# Altium schematic sheet Analog_Supply_and_TIA.SchDoc
size A3; SheetNumber: 1; SheetTotal: 4
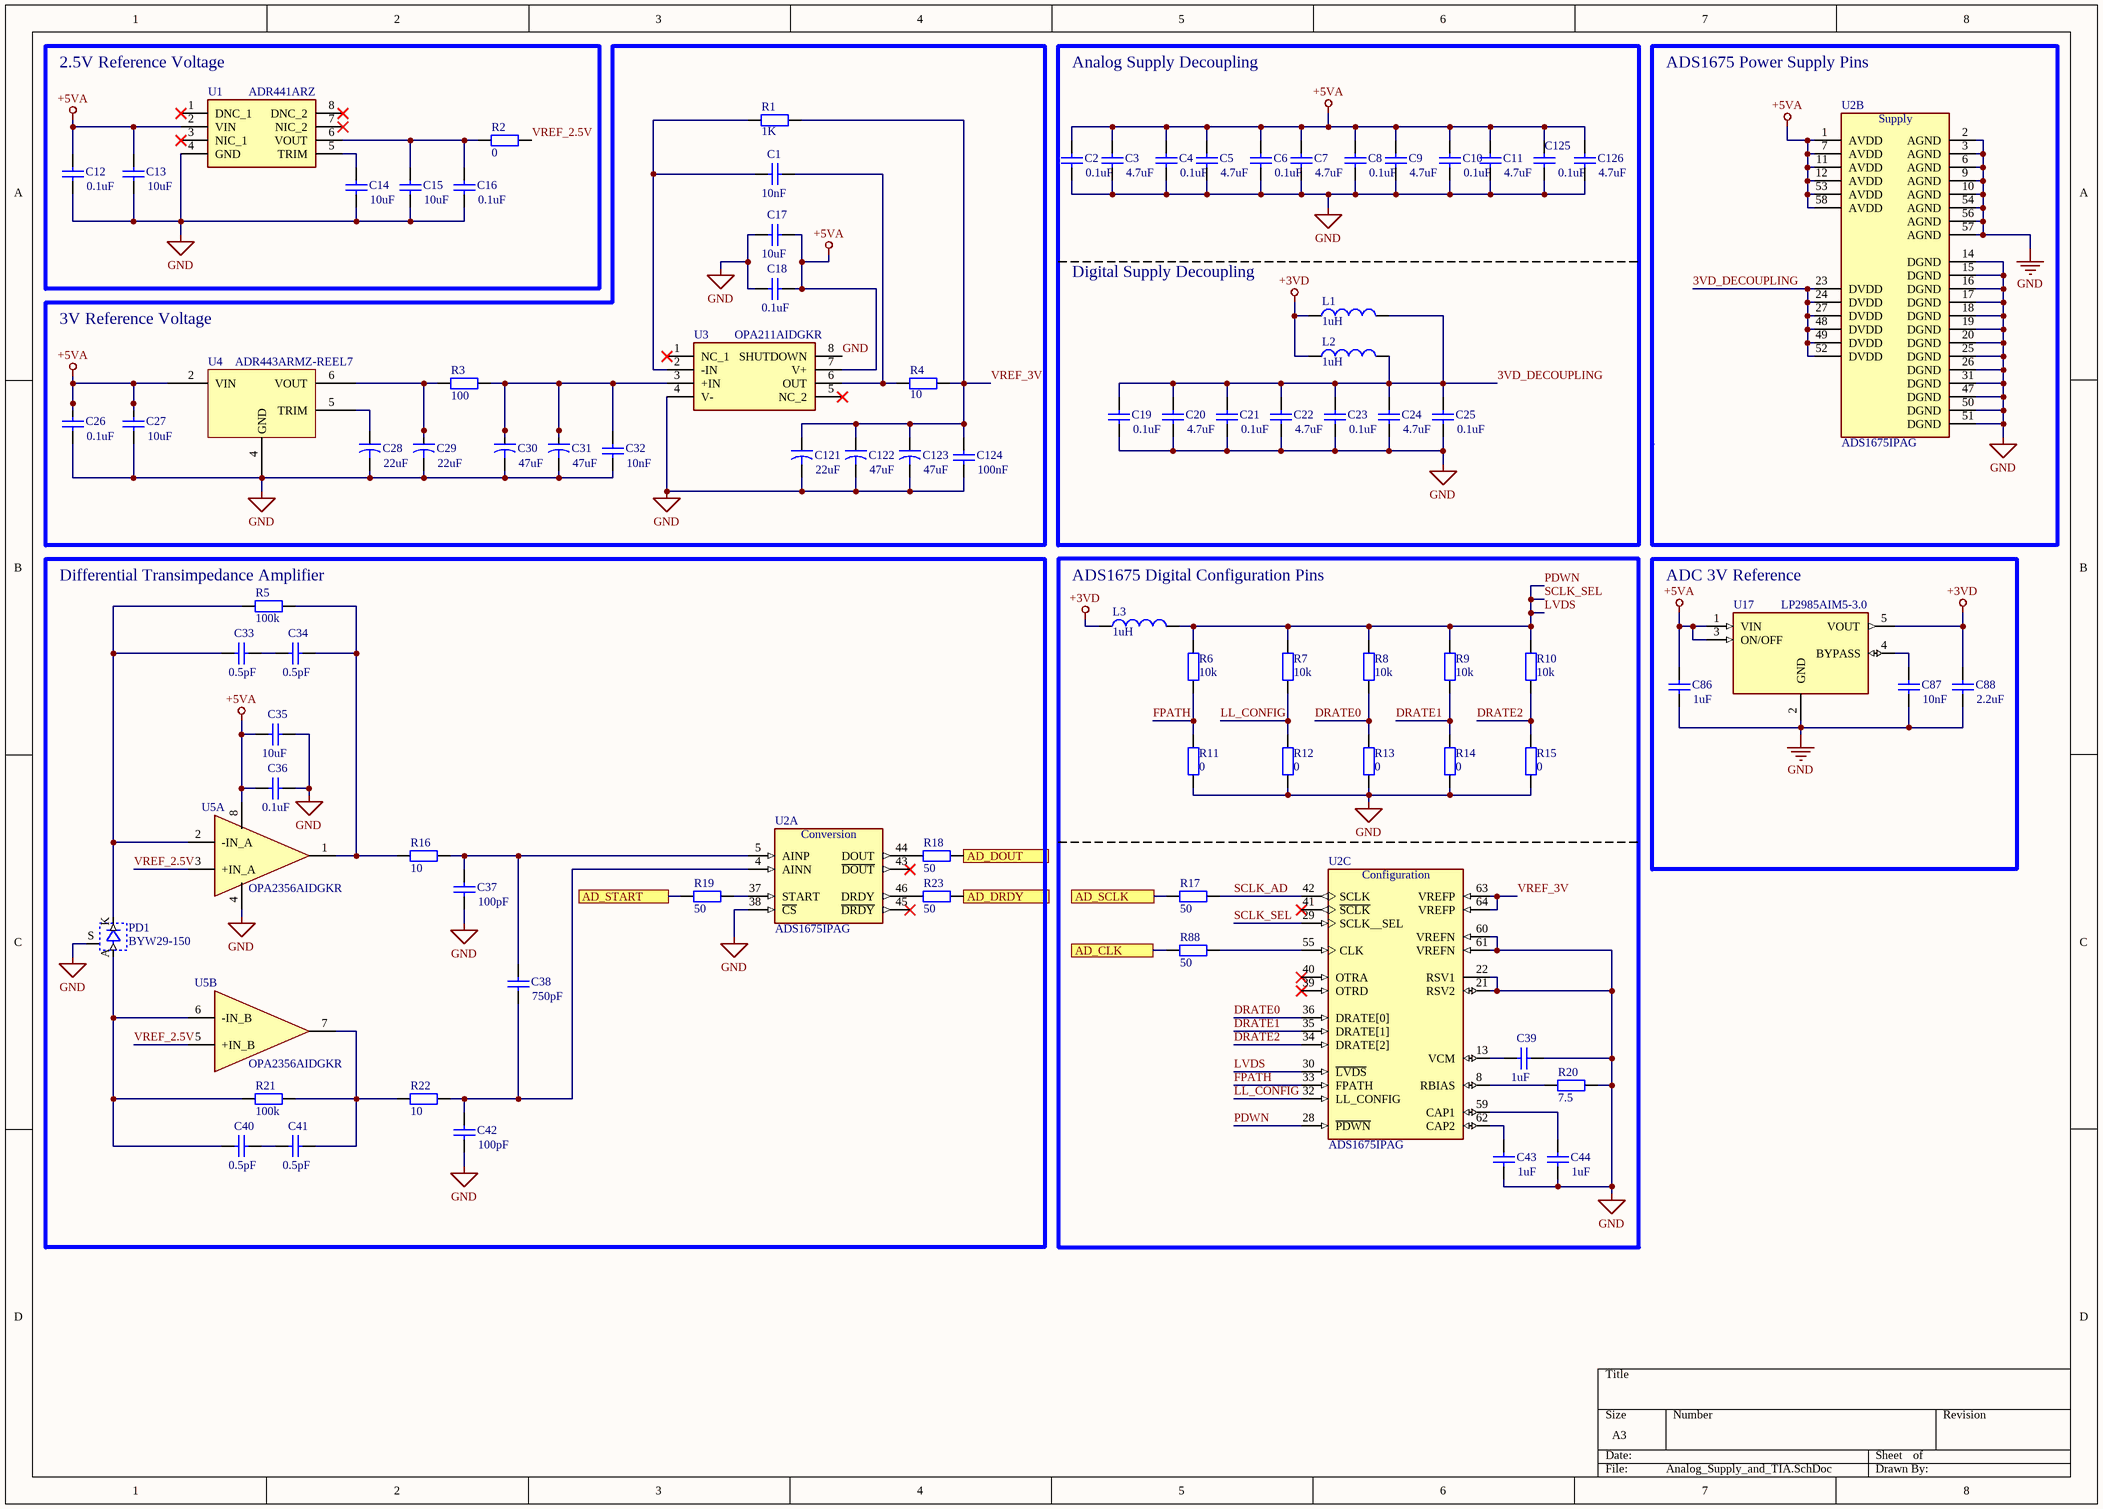
[diagram p0: Analog_Supply_and_TIA.SchDoc]

## Parts
C1  value 10nF  [CC_0805]  (hidden comment: Cap)
C2  value 0.1uF  [CC_0805]  (hidden comment: Cap)
C3  value 4.7uF  [CC_0805]  (hidden comment: Cap)
C4  value 0.1uF  [CC_0805]  (hidden comment: Cap)
C5  value 4.7uF  [CC_0805]  (hidden comment: Cap)
C6  value 0.1uF  [CC_0805]  (hidden comment: Cap)
C7  value 4.7uF  [CC_0805]  (hidden comment: Cap)
C8  value 0.1uF  [CC_0805]  (hidden comment: Cap)
C9  value 4.7uF  [CC_0805]  (hidden comment: Cap)
C10  value 0.1uF  [CC_0805]  (hidden comment: Cap)
C11  value 4.7uF  [CC_0805]  (hidden comment: Cap)
C12  value 0.1uF  [CC_0805]  (hidden comment: Cap)
C13  value 10uF  [CC_0805]  (hidden comment: Cap)
C14  value 10uF  [CC_0805]  (hidden comment: Cap)
C15  value 10uF  [CC_0805]  (hidden comment: Cap)
C16  value 0.1uF  [CC_0805]  (hidden comment: Cap)
C17  value 10uF  [CC_0805]  (hidden comment: Cap)
C18  value 0.1uF  [CC_0805]  (hidden comment: Cap)
C19  value 0.1uF  [CC_0805]  (hidden comment: Cap)
C20  value 4.7uF  [CC_0805]  (hidden comment: Cap)
C21  value 0.1uF  [CC_0805]  (hidden comment: Cap)
C22  value 4.7uF  [CC_0805]  (hidden comment: Cap)
C23  value 0.1uF  [CC_0805]  (hidden comment: Cap)
C24  value 4.7uF  [CC_0805]  (hidden comment: Cap)
C25  value 0.1uF  [CC_0805]  (hidden comment: Cap)
C26  value 0.1uF  [CC_0805]  (hidden comment: Cap)
C27  value 10uF  [CC_0805]  (hidden comment: Cap)
C28  value 22uF  [CC_0805]  (hidden comment: Cap2)
C29  value 22uF  [CC_0805]  (hidden comment: Cap2)
C30  value 47uF  [CC_0805]  (hidden comment: Cap2)
C31  value 47uF  [CC_0805]  (hidden comment: Cap2)
C32  value 10nF  [CC_0805]  (hidden comment: Cap)
C33  value 0.5pF  [CC_0805]  (hidden comment: Cap)
C34  value 0.5pF  [CC_0805]  (hidden comment: Cap)
C35  value 10uF  [CC_0805]  (hidden comment: Cap)
C36  value 0.1uF  [CC_0805]  (hidden comment: Cap)
C37  value 100pF  [CC_0805]  (hidden comment: Cap)
C38  value 750pF  [CC_0805]  (hidden comment: Cap)
C39  value 1uF  [CC_0805]  (hidden comment: Cap)
C40  value 0.5pF  [CC_0805]  (hidden comment: Cap)
C41  value 0.5pF  [CC_0805]  (hidden comment: Cap)
C42  value 100pF  [CC_0805]  (hidden comment: Cap)
C43  value 1uF  [CC_0805]  (hidden comment: Cap)
C44  value 1uF  [CC_0805]  (hidden comment: Cap)
C86  value 1uF  [CC_0805]  (hidden comment: Cap)
C87  value 10nF  [CC_0805]  (hidden comment: Cap)
C88  value 2.2uF  [CC_0805]  (hidden comment: Cap)
C121  value 22uF  [CC_0805]  (hidden comment: Cap2)
C122  value 47uF  [CC_0805]  (hidden comment: Cap2)
C123  value 47uF  [CC_0805]  (hidden comment: Cap2)
C124  value 100nF  [CC_0805]  (hidden comment: Cap)
C125  value 0.1uF  [CC_0805]  (hidden comment: Cap)
C126  value 4.7uF  [CC_0805]  (hidden comment: Cap)
L1  value 1uH  [WE-PMI_0805_H0.5]  (hidden comment: Inductor)
L2  value 1uH  [WE-PMI_0805_H0.5]  (hidden comment: Inductor)
L3  value 1uH  [WE-PMI_0805_H0.5]  (hidden comment: Inductor)
PD1  BYW29-150  [BYW29-150]
R1  value 1K  [RR_1220]  (hidden comment: Res2)
R2  value 0  [RR_1220]  (hidden comment: Res2)
R3  value 100  [RR_1220]  (hidden comment: Res2)
R4  value 10  [RR_1220]  (hidden comment: Res2)
R5  value 100k  [RR_1220]  (hidden comment: Res2)
R6  value 10k  [RR_1220]  (hidden comment: Res2)
R7  value 10k  [RR_1220]  (hidden comment: Res2)
R8  value 10k  [RR_1220]  (hidden comment: Res2)
R9  value 10k  [RR_1220]  (hidden comment: Res2)
R10  value 10k  [RR_1220]  (hidden comment: Res2)
R11  value 0  [RR_1220]  (hidden comment: Res2)
R12  value 0  [RR_1220]  (hidden comment: Res2)
R13  value 0  [RR_1220]  (hidden comment: Res2)
R14  value 0  [RR_1220]  (hidden comment: Res2)
R15  value 0  [RR_1220]  (hidden comment: Res2)
R16  value 10  [RR_1220]  (hidden comment: Res2)
R17  value 50  [RR_1220]  (hidden comment: Res2)
R18  value 50  [RR_1220]  (hidden comment: Res2)
R19  value 50  [RR_1220]  (hidden comment: Res2)
R20  value 7.5  [RR_1220]  (hidden comment: Res2)
R21  value 100k  [RR_1220]  (hidden comment: Res2)
R22  value 10  [RR_1220]  (hidden comment: Res2)
R23  value 50  [RR_1220]  (hidden comment: Res2)
R88  value 50  [RR_1220]  (hidden comment: Res2)
U1  ADR441ARZ  [ADR441ARZ]
U2  ADS1675IPAG  [ADS1675IPAG]  (parts A,B,C of 3)
U3  OPA211AIDGKR  [OPA211AIDGKR]
U4  ADR443ARMZ-REEL7  [ADR443ARMZ-REEL7 - duplicate]
U5  OPA2356AIDGKR  [OPA2356AIDGKR]  (parts A,B of 2)
U17  LP2985AIM5-3.0  [LP2985AIM5-3.0]

## Blocks framed on the sheet
2.5V Reference Voltage: C12-C16 R2 U1
3V Reference Voltage: C1 C17 C18 C26-C32 C121-C124 R1 R3 R4 U3 U4
ADS1675 Power Supply Pins: U2
Differential Transimpedance Amplifier: C33-C38 C40-C42 PD1 R5 R16 R18 R19 R21-R23 U2 U5
ADS1675 Digital Configuration Pins: C39 C43 C44 L3 R6-R15 R17 R20 R88 U2
ADC 3V Reference: C86-C88 U17

## Ports
AD_CLK (see Digital_Connectors_and_IHM[2A], Digital_Connectors_and_IHM[5A], Digital_STMG474RE[3B]), AD_DOUT (see Digital_Connectors_and_IHM[1A], Digital_STMG474RE[3B]), AD_DRDY (see Digital_Connectors_and_IHM[1A], Digital_STMG474RE[3B]), AD_SCLK (see Digital_Connectors_and_IHM[1A], Digital_STMG474RE[5B]), AD_START (see Digital_Connectors_and_IHM[1A], Digital_STMG474RE[3B])

## Nets
+3VD: C88.1 L1.1 L2.1 L3.1 U17.5(VOUT)
+5VA: C2.2 C3.2 C4.2 C5.2 C6.2 C7.2 C8.2 C9.2 C10.2 C11.2 C12.2 C13.2 C17.1 C18.1 C26.2 C27.2 C35.2 C36.2 C86.1 C125.2 C126.2 U1.2(VIN) U2.1(AVDD) U2.7(AVDD) U2.11(AVDD) U2.12(AVDD) U2.53(AVDD) U2.58(AVDD) U3.7(V+) U4.2(VIN) U5.8(V+) U17.1(VIN) U17.3(ON/OFF)
GND: C2.1 C3.1 C4.1 C5.1 C6.1 C7.1 C8.1 C9.1 C10.1 C11.1 C12.1 C13.1 C14.1 C15.1 C16.1 C17.2 C18.2 C19.1 C20.1 C21.1 C22.1 C23.1 C24.1 C25.1 C26.1 C27.1 C28.2 C29.2 C30.2 C31.2 C32.1 C35.1 C36.1 C37.1 C39.1 C42.1 C43.2 C44.2 C86.2 C87.2 C88.2 C121.2 C122.2 C123.2 C124.1 C125.1 C126.1 PD1.S R11.1 R12.1 R13.1 R14.1 R15.1 R20.2 U1.4(GND) U2.2(AGND) U2.3(AGND) U2.6(AGND) U2.9(AGND) U2.10(AGND) U2.14(DGND) U2.15(DGND) U2.16(DGND) U2.17(DGND) U2.18(DGND) U2.19(DGND) U2.20(DGND) U2.21(RSV2) U2.22(RSV1) U2.25(DGND) U2.26(DGND) U2.31(DGND) U2.38(~{CS}) U2.47(DGND) U2.50(DGND) U2.51(DGND) U2.54(AGND) U2.56(AGND) U2.57(AGND) U2.60(VREFN) U2.61(VREFN) U3.4(V-) U3.8(SHUTDOWN) U4.4(GND) U5.4(V-) U17.2(GND)
3VD_DECOUPLING: C19.2 C20.2 C21.2 C22.2 C23.2 C24.2 C25.2 L1.2 L2.2 U2.23(DVDD) U2.24(DVDD) U2.27(DVDD) U2.48(DVDD) U2.49(DVDD) U2.52(DVDD)
AD_CLK: R88.1 ; port AD_CLK
AD_DOUT: R18.2 ; port AD_DOUT
AD_DRDY: R23.2 ; port AD_DRDY
AD_SCLK: R17.1 ; port AD_SCLK
AD_START: R19.1 ; port AD_START
DRATE0: R8.1 R13.2 U2.36(DRATE[0])
DRATE1: R9.1 R14.2 U2.35(DRATE[1])
DRATE2: R10.1 R15.2 U2.34(DRATE[2])
FPATH: R6.1 R11.2 U2.33(FPATH)
LL_CONFIG: R7.1 R12.2 U2.32(LL_CONFIG)
LVDS: L3.2 R6.2 R7.2 R8.2 R9.2 R10.2 U2.28(~{PDWN}) U2.29(SCLK__SEL) U2.30(~{LVDS})  [also labelled PDWN, SCLK_SEL]
SCLK_AD: R17.2 U2.42(SCLK)
VREF_2.5V: R2.2 U5.3(+IN_A) U5.5(+IN_B)
VREF_3V: C121.1 C122.1 C123.1 C124.2 R1.1 R4.1 U2.63(VREFP) U2.64(VREFP)
NetC1_1: C1.1 R4.2 U3.6(OUT)
NetC1_2: C1.2 R1.2 U3.2(-IN)
NetC14_2: C14.2 U1.5(TRIM)
NetC15_2: C15.2 C16.2 R2.1 U1.6(VOUT)
NetC28_1: C28.1 U4.5(TRIM)
NetC29_1: C29.1 R3.1 U4.6(VOUT)
NetC30_1: C30.1 C31.1 C32.2 R3.2 U3.3(+IN)
NetC33_1: C33.1 C34.2
NetC33_2: C33.2 PD1.K R5.1 U5.2(-IN_A)
NetC34_1: C34.1 R5.2 R16.1 U5.1(OUT_A)
NetC37_2: C37.2 C38.2 R16.2 U2.5(AINP)
NetC38_1: C38.1 C42.2 R22.2 U2.4(AINN)
NetC39_2: C39.2 U2.13(VCM)
NetC40_1: C40.1 C41.2
NetC40_2: C40.2 PD1.A R21.1 U5.6(-IN_B)
NetC41_1: C41.1 R21.2 R22.1 U5.7(OUT_B)
NetC43_1: C43.1 U2.62(CAP2)
NetC44_1: C44.1 U2.59(CAP1)
NetC87_1: C87.1 U17.4(BYPASS)
NetR18_1: R18.1 U2.44(DOUT)
NetR19_2: R19.2 U2.37(START)
NetR20_1: R20.1 U2.8(RBIAS)
NetR23_1: R23.1 U2.46(DRDY)
NetR88_2: R88.2 U2.55(CLK)

Not connected (* = marked no-connect by the designer): U1 1(DNC_1)* 3(NIC_1)* 7(NIC_2)* 8(DNC_2)*; U2 39(OTRD)* 40(OTRA)* 41(~{S}~{C}~{L}~{K})* 43(~{DOUT})* 45(~{DRDY})*; U3 1(NC_1)* 5(NC_2)*

## Notes on the sheet
- Analog Supply Decoupling
- (near L1) Digital Supply Decoupling
- (in symbol ADS1675IPAG, part A) Conversion
- (in symbol ADS1675IPAG, part B) Supply
- (in symbol ADS1675IPAG, part C) Configuration

## Library data of the parts
C1-C27 C32-C44 C86-C88 C124-C126 = Cap: Capacitor; Published: 8-Jun-2000; LatestRevisionDate: 17-Jul-2002; LatestRevisionNote: Re-released for DXP Platform.; PackageReference: RAD-0.3; Publisher: Altium Limited; PackageDescription: Radial Cap, Thru-Hole; 2 Leads; 0.3 in Pin Spacing
C28-C31 C121-C123 = Cap2: Capacitor; Published: 23-Sep-2002; PackageReference: CAPR5-4X5; Publisher: Altium Limited; PackageDescription: Capacitor; 2 Leads
L1-L3 = Inductor: Code_IEC: 1005; Published: 8-Jun-2000; LatestRevisionDate: 29-May-2009; LatestRevisionNote: IPC-7351 Footprint Added.; PackageReference: 0402-A; Publisher: Altium Limited; PackageDescription: Chip Inductor; Code_JEITA: 0402
PD1 = BYW29-150: Text Field1: 10; Text Field2: 20
R1-R23 R88 = Res2: Resistor; Published: 8-Jun-2000; LatestRevisionDate: 17-Jul-2002; LatestRevisionNote: Re-released for DXP Platform.; PackageReference: AXIAL-0.4; Publisher: Altium Limited; PackageDescription: Axial Device, Thru-Hole; 2 Leads; 0.4 in Pin Spacing
U1 = ADR441ARZ: Series Voltage Reference IC Fixed 2.5V V +/-0.12% 10 mA 8-SOIC; Manufacturer_Name: Analog Devices; Geometry.Height: 1.75mm; Manufacturer_Part_Number: ADR441ARZ; Mouser Part Number: 584-ADR441ARZ; Mouser Price/Stock: https://www.mouser.co.uk/ProductDetail/Analog-Devices/ADR441ARZ?qs=WIvQP4zGanjF%252B9HT%2FrItQQ%3D%3D; Arrow Part Number: ADR441ARZ; Arrow Price/Stock: https://www.arrow.com/en/products/adr441arz/analog-devices?region=europe; Datasheet Link: https://www.analog.com/media/en/technical-documentation/data-sheets/adr440_441_443_444_445.pdf
U2 = ADS1675IPAG: 4MSPS, 24-Bit Analog-to-Digital Converter; MF: Texas Instruments; SnapEDA_Link: https://www.snapeda.com/parts/ADS1675IPAG/Texas+Instruments/view-part/?ref=snap; Package: TQFP-64 Texas Instruments; MP: ADS1675IPAG; Check_prices: https://www.snapeda.com/parts/ADS1675IPAG/Texas+Instruments/view-part/?ref=eda; Purchase-URL: https://pricing.snapeda.com/search/part/ADS1675IPAG/?ref=eda; Price: None; Value: *; Availability: In Stock
U3 = OPA211AIDGKR: Precision Amplifiers 1.1nV/rtHz Noise Lo Pwr Prec Op Amp; Manufacturer_Name: Texas Instruments; Geometry.Height: 1.1mm; Manufacturer_Part_Number: OPA211AIDGKR; Mouser Part Number: 595-OPA211AIDGKR; Mouser Price/Stock: https://www.mouser.co.uk/ProductDetail/Texas-Instruments/OPA211AIDGKR?qs=iSMark9AYDXgBzgxm95hVg%3D%3D; Arrow Part Number: OPA211AIDGKR; Arrow Price/Stock: https://www.arrow.com/en/products/opa211aidgkr/texas-instruments?utm_currency=USD&region=nac; Datasheet Link: https://www.ti.com/general/docs/suppproductinfo.tsp?distId=10&gotoUrl=https%3A%2F%2Fwww.ti.com%2Flit%2Fgpn%2Fopa211
U4 = ADR443ARMZ-REEL7: Ultralow Noise, LDO XFET Voltage Reference with Current Sink and Source, 3 V Output, 3.5 to 18 V Supply, Industrial, 8-pin SOP (RM-8), Reel
U5 = OPA2356AIDGKR: High Speed Operational Amplifiers 2.5V 200MHz GBW CMOS Dual Op Amp; Manufacturer_Name: Texas Instruments; Geometry.Height: 1.1mm; Manufacturer_Part_Number: OPA2356AIDGKR; Mouser Part Number: 595-OPA2356AIDGKR; Mouser Price/Stock: https://www.mouser.co.uk/ProductDetail/Texas-Instruments/OPA2356AIDGKR?qs=7nS3%252BbEUL6thmoW05USD8Q%3D%3D; Arrow Part Number: OPA2356AIDGKR; Arrow Price/Stock: https://www.arrow.com/en/products/opa2356aidgkr/texas-instruments?region=nac; Datasheet Link: http://www.ti.com/lit/ds/symlink/opa2356.pdf
U17 = LP2985AIM5-3.0: 150-mA, 16-V, low-dropout voltage regulator with enable; MF: Texas Instruments; MP: LP2985AIM5-3.0/NOPB; SnapEDA_Link: https://www.snapeda.com/parts/LP2985AIM5-3.0/NOPB/Texas+Instruments/view-part/?ref=snap; Package: SOT-23-5 Texas Instruments; Value: *; Check_prices: https://www.snapeda.com/parts/LP2985AIM5-3.0/NOPB/Texas+Instruments/view-part/?ref=eda